# Altium schematic sheet CarrierBoard.SchDoc: Sanhaço - CarrierBoard
size A4; DocumentNumber: CB01; Revision: 1.1; SheetNumber: 1; SheetTotal: 4; ProjectName: CarrierBoard - Sanhaço
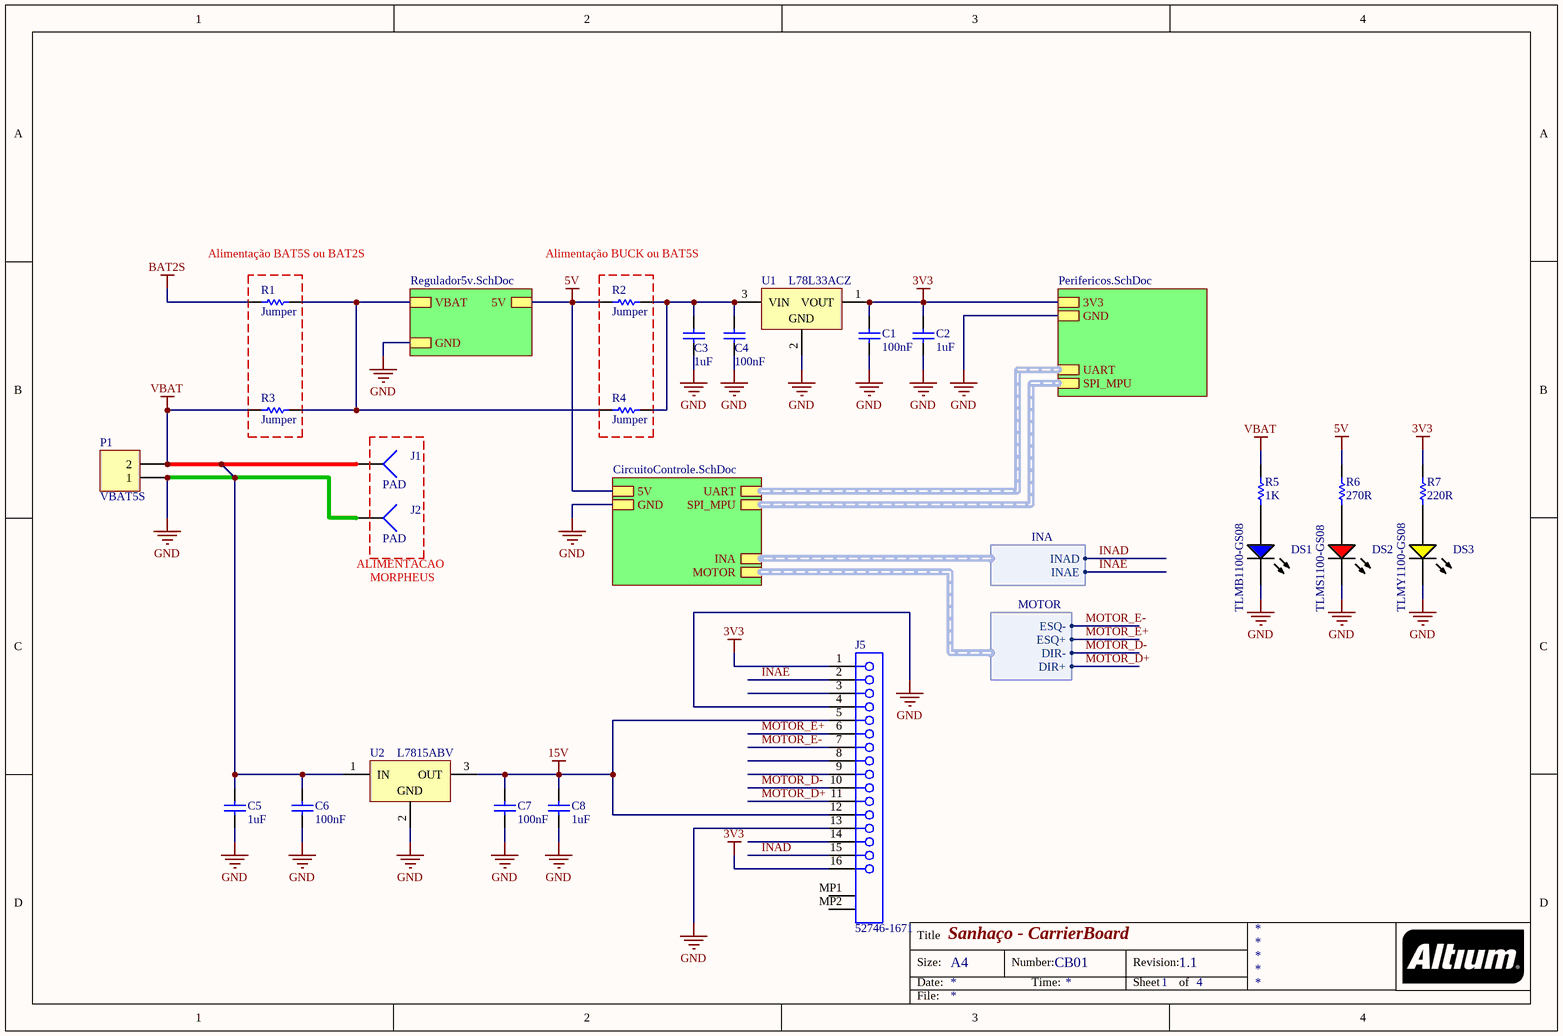
[diagram p0: CarrierBoard.SchDoc]

## Parts
C1  100nF  [CAPC0805(2012)145_N]
C2  1uF  [CAPC0805(2012)145_L]
C3  1uF  [CAPC0805(2012)145_L]
C4  100nF  [CAPC0805(2012)145_N]
C5  1uF  [CAPC0805(2012)145_L]
C6  100nF  [CAPC0805(2012)145_N]
C7  100nF  [CAPC0805(2012)145_N]
C8  1uF  [CAPC0805(2012)145_L]
DS1  TLMB1100-GS08  [VISH-TLMX1100-2_V]
DS2  TLMS1100-GS08  [VISH-TLMX1100_V]
DS3  TLMY1100-GS08  [VISH-TLMX1100-2_V]
J1  PAD  [PIN1]
J2  PAD  [PIN1]
J5  52746-1671  [MOLX-52746-1671]
P1  VBAT5S  [HDR1X2]
R1  Jumper  [RESC0805(2012)_N]
R2  Jumper  [RESC0805(2012)_N]
R3  Jumper  [RESC0805(2012)_N]
R4  Jumper  [RESC0805(2012)_N]
R5  1K  [RESC0805(2012)_N]
R6  270R  [RESC0402(1005)_N]
R7  220R  [RESC0805(2012)_N]
U1  L78L33ACZ  [TO-92]
U2  L7815ABV  [TO220]

## Sub-sheets
Designator = Regulador5v.SchDoc: VBAT, 5V, GND
Designator = Perifericos.SchDoc: 3V3, GND, SPI_MPU (harness SPI_MPU), UART (harness UART)
Designator = CircuitoControle.SchDoc: 5V, GND, UART (harness UART), SPI_MPU (harness SPI_MPU), MOTOR (harness MOTOR), INA (harness INA)

## Harnesses
INA: INAD, INAE
MOTOR: ESQ+, DIR-, DIR+, ESQ-

## Nets
3V3: C1.2 C2.2 J5.1 J5.16 R7.2 U1.1(VOUT) ; sheet Designator/3V3
5V: R2.1 R6.2 ; sheet Designator/5V, sheet Designator/5V
15V: C7.2 C8.2 J5.5 J5.12 U2.3(OUT)
BAT2S: R1.1
GND: C1.1 C2.1 C3.1 C4.1 C5.1 C5.2 C6.1 C6.2 C7.1 C8.1 DS1.2(K) DS2.2(K) DS3.2(K) J1.1 J2.1 J5.4 J5.13 P1.1 P1.2 R3.1 R5.2 U1.2(GND) U2.1(IN) U2.2(GND) ; sheet Designator/GND, sheet Designator/GND, sheet Designator/GND  [also labelled VBAT]
INAD: J5.15 ; sheet Designator/INA.INAD
INAE: J5.2 ; sheet Designator/INA.INAE
MOTOR_D+: J5.11 ; sheet Designator/MOTOR.DIR+
MOTOR_D-: J5.10 ; sheet Designator/MOTOR.DIR-
MOTOR_E+: J5.6 ; sheet Designator/MOTOR.ESQ+
MOTOR_E-: J5.7 ; sheet Designator/MOTOR.ESQ-
NetC3_2: C3.2 C4.2 R2.2 R4.2 U1.3(VIN)
NetDS1_1: DS1.1(A) R5.1
NetDS2_1: DS2.1(A) R6.1
NetDS3_1: DS3.1(A) R7.1
NetR1_2: R1.2 R3.2 R4.1 ; sheet Designator/VBAT

Not connected (* = marked no-connect by the designer): J5 3 8 9 14 MP1 MP2

## Notes on the sheet
- (near R1) Alimentação BAT5S ou BAT2S
- (near R2) Alimentação BUCK ou BAT5S
- (near J2) ALIMENTACAO
- MORPHEUS
- Title
- Size:
- Date:
- A4
- Number:
- Time:
- Revision:
- Sheet
- of
- File:

## Library data of the parts
C1 C4 C6 C7 = CMP-1036-04417-1: CAP 100nF 50V ±5% 0805 (2012 Metric) Thickness 1.45mm SMD; Case-Metric: 2012; Tolerance: Â±5%; Case-EIA: 0805; Max Thickness: 1.45 mm; Rated Voltage: 50 V; Value: 100nF; Technology: SMT
C2 C3 C5 C8 = CMP-1036-04761-1: CAP 1uF 50V ±10% 0805 (2012 Metric) Thickness 1.45mm SMD; Tolerance: Â±10%; Case-EIA: 0805; Case-Metric: 2012; Technology: SMT; Value: 1uF; Max Thickness: 1.45 mm; Rated Voltage: 50 V
DS1 = CMP-1666-00028-1: Blue LED, 10 mA, 3.9 V, -40 to 100 degC, 2-Pin SMD (0603), RoHS, Tape and Reel                  TLMB1100-GS08; Tolerance: 10%; Voltage Rating: 100 V; Capacitance: 10 nF; Type (Capacitors): X7R; Case\Package: Radial; ComponentLink1Description: Manufacturer URL; REACH SVHC: No SVHC; Package Quantity: 500; PackageDescription: 2-Pin Surface Mount Device, Body 1.6 x 0.8 mm; Pins: 2; ComponentLink2URL: http://download.siliconexpert.com/pdfs/2016/8/7/12/43/26/667/vsh_/manual/379263299541529tlmb1100.pdf; RoHSCompliant: true; Lead Pitch: 2.54 mm; Height: 2.54 mm; DatasheetVersion: Rev. 2.7, 03/2016; Length: 5.33 mm; ComponentLink1URL: http://www.vishay.com/; Min Operating Temperature: -55 degC; PackageReference: 0603; Packaging: Bulk; ComponentLink2Description: Datasheet; Max Operating Temperature: 125 degC; Radiation Hardening: No; Width: 3.81 mm; Mount: Through Hole
DS2 = CMP-1666-00027-1: LED, RED, 2.1 V, -40 to 100 degC, 2-Pin SMD (0603), RoHS, Tape and Reel; Type (Capacitors): C0G; Resistance: 100000000000 Ohm; Capacitance: 12 pF; Voltage Rating: 50 V; Tolerance: 5%; Min Operating Temperature: -55degC; REACH SVHC: No SVHC; ComponentLink2Description: Datasheet; ComponentLink1URL: http://www.vishay.com/; Width: 0.8 mm; Package Quantity: 4000; PackageReference: TLMX1100; ComponentLink2URL: http://www.vishay.com/docs/83173/tlmb1100.pdf; Case/Package: 0603; Case Code (Metric): 1608; Packaging: Tape and Reel; Pins: 2; ComponentLink1Description: Manufacturer URL; Max Operating Temperature: 125degC; Height: 0.8 mm; Length: 1.6 mm; Mount: Surface Mount; PackageDescription: 2-Pin Surface Mount Device, Body 1.6 x 0.8 mm; DatasheetVersion: Rev. 2.7, 03/2016; Case Code (Imperial): 0603; Voltage Rating (DC): 50 V; RoHSCompliant: True; Radiation Hardening: No
DS3 = CMP-1666-00030-1: Yellow LED, 20 mA, 2.1 V, -40 to 100 degC, 2-Pin SMD (0603), RoHS, Tape and Reel             TLMY1100-GS08; ComponentLink2Description: Datasheet; ComponentLink2URL: http://download.siliconexpert.com/pdfs/2016/8/7/12/43/26/667/vsh_/manual/379263299541529tlmb1100.pdf; ComponentLink1Description: Manufacturer URL; PackageDescription: 2-Pin Surface Mount Device, Body 1.6 x 0.8 mm; DatasheetVersion: Rev. 2.7, 03/2016; ComponentLink1URL: http://www.vishay.com/; PackageReference: 0603
J1 J2 = Socket: LatestRevisionDate: 17-Jul-2002; LatestRevisionNote: Re-released for DXP Platform.; Publisher: Altium Limited
J5 = CMP-1241-00378-1: 0.5 mm Pitch Easy-On(TM) Type FPC Connector, 2.0 mm Mated Height, Right Angle, ZIF, SMT, Bottom Contact, 16 Circuits, -20 to 85 degC, ELV and RoHS Compliant, Tape and Reel; Manufacturer: Molex; Voltage (Max): 50V; Durability (mating cycles max): 20; Current (Max per Contact): 0.5A; Pitch - Mating Interface: 0.50mm; PCB Retention: Yes; Stackable: No; Circuits (Loaded): 16; Material - Plating Termination: Gold; Mated Height: 2.00mm; Material - Metal: Phosphor Bronze; Entry Angle: 90degrees Angle; PackageVersion: Rev. H, 05/2009; ComponentLink1URL: http://www.molex.com/molex/index.jsp; PackageReference: 52746-1671; Contact Position: Bottom; Packing: Tape and Reel; Number of Rows: 1; ComponentLink1Description: Manufacturer URL; Mounting Technology: Surface Mount; RoHS: TRUE; Polarized to PCB: Yes; PackageDescription: 16-Lead FPC Connector, Pitch 0.5 mm; ComponentLink3Description: Package Specification; Material - Plating Mating: Gold; ComponentLink3URL: http://www.molex.com/pdm_docs/sd/527461671_sd.pdf; ComponentLink2Description: Datasheet; Orientation: Right Angle; PCB Locator: No; ComponentLink2URL: http://www.molex.com/webdocs/datasheets/pdf/en-us/0527461671_FFC_FPC_CONNECTORS.pdf; PartNumber: 52746-1671
P1 = Header 2: Header, 2-Pin; LatestRevisionDate: 17-Jul-2002; LatestRevisionNote: Re-released for DXP Platform.; Publisher: Altium Limited
R1-R4 = CMP-1013-00001-1: Jumper 0805 (2012 Metric); Case-EIA: 0805; Value: 0.00 Ohm; Tolerance: None; Case-Metric: 2012; Technology: SMT; Power: None
R5 = CMP-1013-00074-1: 1K 0.125W 5% 0805 (2012 Metric)  SMD                                667-ERJ-P06J102V; Case-EIA: 0805; Case-Metric: 2012; Power: 0.500 W; Value: 1000.00 Ohm; Technology: SMT; Tolerance: 5 %
R6 = CMP-1011-00060-1: 270R 0.063W 5% 0402 (1005 Metric)  SMD                             603-AC0402JR-07270RL; Case-Metric: 1005; Value: 270.00 Ohm; Case-EIA: 0402; Tolerance: 5 %; Technology: SMT; Power: 0.063 W
R7 = CMP-1013-00058-1: 220R 0.125W 5% 0805 (2012 Metric)  SMD                               603-RC0805JR-7W220RL; Power: 0.250 W; Value: 220.00 Ohm; Case-Metric: 2012; Case-EIA: 0805; Technology: SMT; Tolerance: 5 %
U1 = CMP-0244-00039-1: Positive Voltage Regulator, 3.3V, 3-Pin TO-92; PackageDescription: TO, Flat Index; 3 In-Line, Axial Leads; Body Dia. 4.7mm; Lead Dia. 0.56 mm (max); ComponentLink1Description: Manufacturer URL; PackageVersion: 2011; ComponentLink2URL: http://www.st.com/internet/com/TECHNICAL_RESOURCES/TECHNICAL_LITERATURE/DATASHEET/CD00000446.pdf; ComponentLink1URL: http://www.st.com; PackageReference: TO-92; DatasheetVersion: 1/02/2011; ComponentLink2Description: Datasheet
U2 = CMP-0244-00468-1: Positive Voltage Regulator, 15V, 3-Pin TO-220; ComponentLink1URL: http://www.st.com; ComponentLink3Description: Package Specification; ComponentLink3URL: http://www.st.com/internet/com/TECHNICAL_RESOURCES/TECHNICAL_LITERATURE/PACKAGE_INFORMATION/CD00004649.pdf; DatasheetVersion: 16/11/2011; ComponentLink2URL: http://www.st.com/internet/com/TECHNICAL_RESOURCES/TECHNICAL_LITERATURE/DATASHEET/CD00000444.pdf; PackageDescription: TO, Thru-Hole, Vertical, Heatsink Mounted; 3 In-Line Leads; Pitch 2.54 mm; ComponentLink1Description: Manufacturer URL; PackageVersion: ver3.0; ComponentLink2Description: Datasheet; PackageReference: TO220